# EAGLE design AC-DC-Supply-M1 (EAGLE 9.6.2)
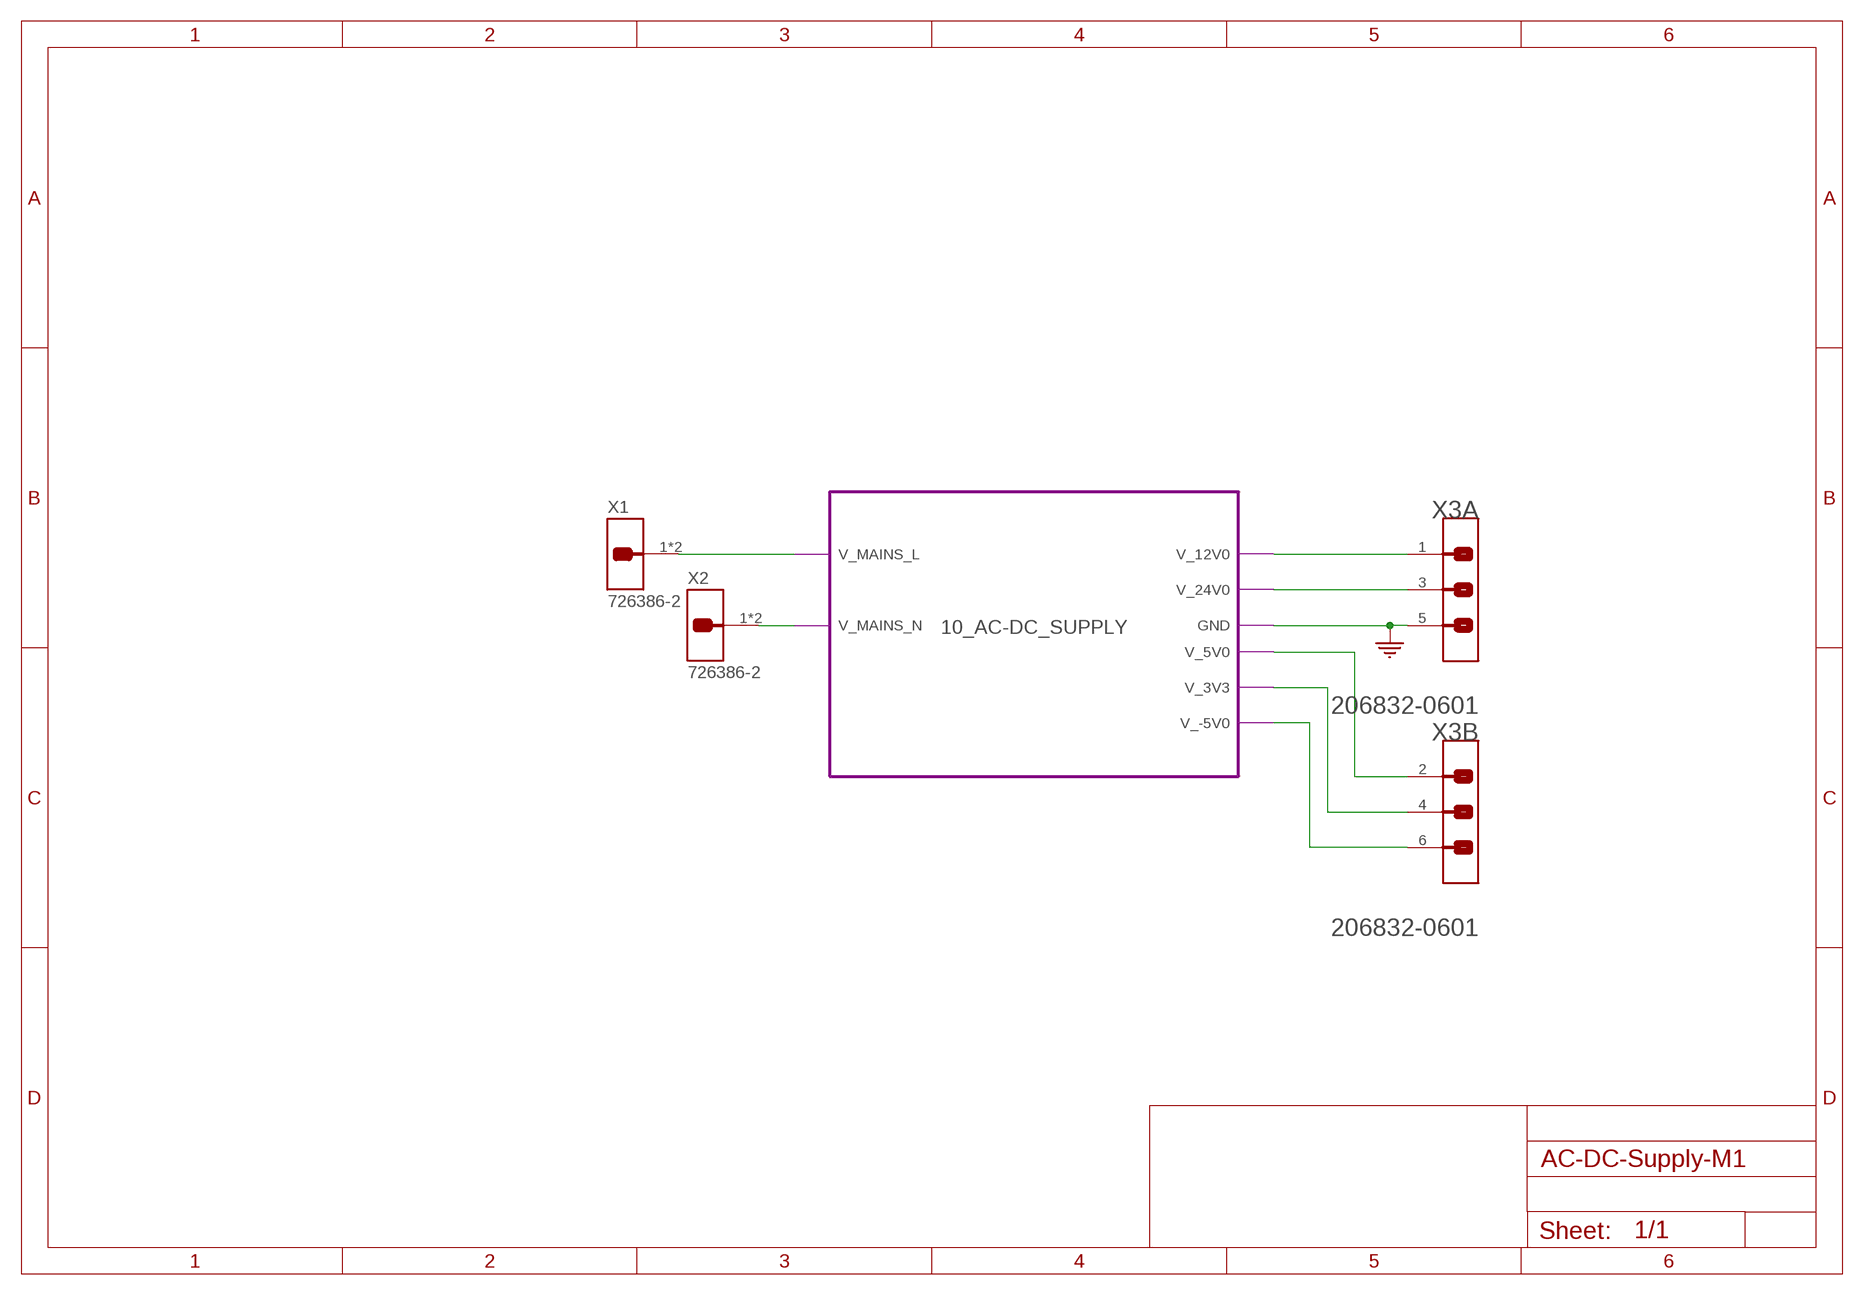
[diagram p0: schematic, sheet 1]

## Parts
X1  726386-2  [TE_726386-2_MODIFIED]
X2  726386-2  [TE_726386-2_MODIFIED]
X3  MOLEX_206832-0601MOLEX_206832-0601  [MOLEX_206832-0601]

## Module instances
10_AC-DC_SUPPLY = AC-DC_SUPPLY (part numbers offset by 100)

## Nets
GND: X3.5 ; port 10_AC-DC_SUPPLY.GND
N$1: X1.1 X1.1-2 ; port 10_AC-DC_SUPPLY.V_MAINS_L
N$2: X2.1 X2.1-2 ; port 10_AC-DC_SUPPLY.V_MAINS_N
V_3V3: X3.4 ; port 10_AC-DC_SUPPLY.V_3V3
V_5V0: X3.2 ; port 10_AC-DC_SUPPLY.V_5V0
V_12V0: X3.1 ; port 10_AC-DC_SUPPLY.V_12V0
V_24V0: X3.3 ; port 10_AC-DC_SUPPLY.V_24V0
V_-5V0: X3.6 ; port 10_AC-DC_SUPPLY.V_-5V0

## Library data of the parts
X1 X2 = Labops_Lib_AH:726386-2: Terminals, Faston, GDS-Flachstecker 6.3x0.8mm, TE; DESCRIPTION: 0.250" (6.35mm) Quick Connect Male - Solder Connector Non-Insulated; MFN: 726386-2; MFR: TE Connectivity; PART_VALUE: 6.35mmx8mm; PRICE-1: 0.24; SUPPLIER-1: Digikey
X3 = Labops_Lib_AH:MOLEX_206832-0601: Connector Header Through Hole 6 position 0.118" (3.00mm); DESCRIPTION: Connector Header Through Hole 6 position 3mm Microfit; LIB_STATUS: Prototype; MFN: 206832-0601; MFR: Molex; OUR_STOCK: 20; PART_VALUE: 6CCT x 2Row; PRICE-1: 1.32; SUPPLIER-1: Digikey

## Module AC-DC_SUPPLY
Ports: V_MAINS_L(io) V_MAINS_N(io) V_24V0(io) V_12V0(io) V_5V0(io) V_3V3(io) GND(io) V_-5V0(io)
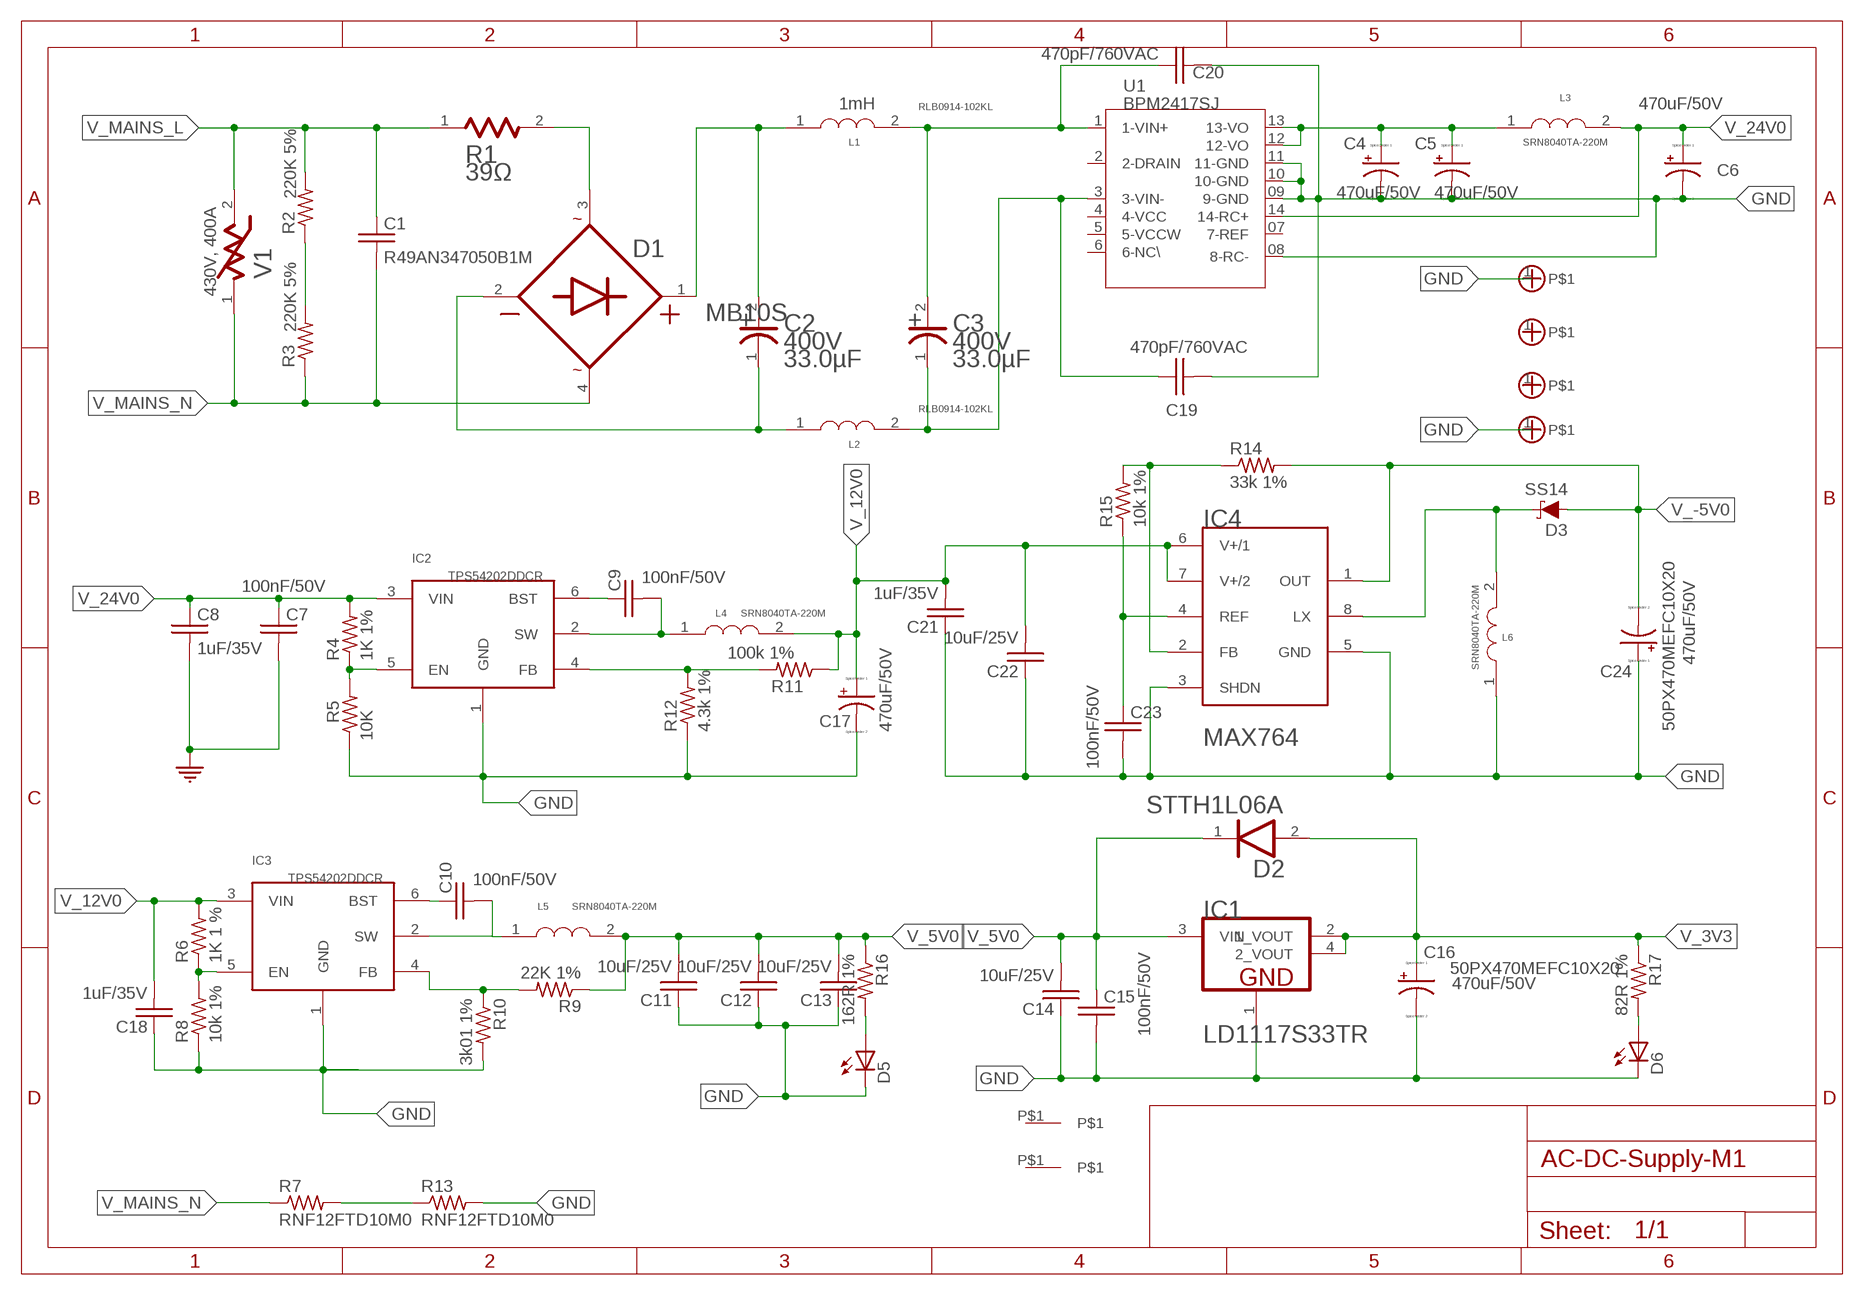
[diagram p1: schematic, module AC-DC_SUPPLY, sheet 1]

### Parts
C1  R49AN347050B1M  [R49AN347050B1M]
C2  860011378008  [RADIAL_D13.0P5.0H25.0]
C3  860011378008  [RADIAL_D13.0P5.0H25.0]
C4  50PX470MEFC10X20  [CAPACITOR-ELKO-RM5-10X16]
C5  50PX470MEFC10X20  [CAPACITOR-ELKO-RM5-10X16]
C6  50PX470MEFC10X20  [CAPACITOR-ELKO-RM5-10X16]
C7  100nF/50V  C_0603  [0603]
C8  1uF/35V  C_0603  [0603]
C9  100nF/50V  C_0603  [0603]
C10  100nF/50V  C_0603  [0603]
C11  10uF/25V  C_0603  [0603]
C12  10uF/25V  C_0603  [0603]
C13  10uF/25V  C_0603  [0603]
C14  10uF/25V  C_0603  [0603]
C15  100nF/50V  C_0603  [0603]
C16  50PX470MEFC10X20  [CAPACITOR-ELKO-RM5-10X16]
C17  50PX470MEFC10X20  [CAPACITOR-ELKO-RM5-10X16]
C18  1uF/35V  C_0603  [0603]
C19  ERP610W471MEF0  [CAP-P12.5-H15-W4-D1]
C20  ERP610W471MEF0  [CAP-P12.5-H15-W4-D1]
C21  1uF/35V  C_0603  [0603]
C22  10uF/25V  C_0603  [0603]
C23  100nF/50V  C_0603  [0603]
C24  50PX470MEFC10X20  [CAPACITOR-ELKO-RM5-10X16]
D1  MB10S  [SOIC4W]
D2  STTH1L06ASTMICROELECTRONICS_STTH1L06A_0_0  [SMA_STTH1L06A]
D3  SS14  [SMA]
D5  26-21/GPC-F3138B/CA  [SMD1206-LED]
D6  26-21/GPC-F3138B/CA  [SMD1206-LED]
FID1  FIDUCIAL  [FIDUCIAL]
FID2  FIDUCIAL  [FIDUCIAL]
IC1  LD1117S33TR  [SOT223_LD1117S33TR]
IC2  TPS54202DDCR  [SOT23-6]
IC3  TPS54202DDCR  [SOT23-6]
IC4  MAX764CSA+  [SOIC8]
L1  RLB0914-102KL  [THTINDUCTOR8MM7]
L2  RLB0914-102KL  [THTINDUCTOR8MM7]
L3  SRN8040TA-220M  [SRN8040TA-220M]
L4  SRN8040TA-220M  [SRN8040TA-220M]
L5  SRN8040TA-220M  [SRN8040TA-220M]
L6  SRN8040TA-220M  [SRN8040TA-220M]
M1  M_HOLE_3M  [PCB_SCREW_M3_POWER]
M2  M_HOLE_3M  [PCB_SCREW_M3_POWER]
M3  M_HOLE_3M  [PCB_SCREW_M3_POWER]
M4  M_HOLE_3M  [PCB_SCREW_M3_POWER]
R1  ERG-2SJ390V  [ERG-2SJ390V_0]
R2  R_1206  [R1206]
R3  R_1206  [R1206]
R4  1K 1%  R_0603  [R0603]
R5  10K  R_0603  [R0603]
R6  1K 1 %  R_0603  [R0603]
R7  RNF12FTD10M0  [RES-RM12.5-VR37]
R8  10k 1%  R_0603  [R0603]
R9  22K 1%  R_0603  [R0603]
R10  3k01 1%  R_0603  [R0603]
R11  100k 1%  R_0603  [R0603]
R12  4.3k 1%  R_0603  [R0603]
R13  RNF12FTD10M0  [RES-RM12.5-VR37]
R14  33k 1%  R_0603  [R0603]
R15  10k 1%  R_0603  [R0603]
R16  162R 1%  R_0603  [R0603]
R17  82R 1%  R_0603  [R0603]
U1  BPM2417SJ  [BPM2417SJ]
V1  B72205S0271K101B72205S2131K101  [EPCOS_B72205S0271K101_0]

### Nets
GND: C4.2(-) C5.2(-) C6.2(-) C7.2 C8.2 C11.1 C12.1 C13.1 C14.1 C15.2 C16.2(-) C17.2(-) C18.1 C19.P$2 C20.P$2 C21.1 C22.1 C23.2 C24.1(+) D5.2(C) D6.2(C) IC1.1(GND) IC2.1(GND) IC3.1(GND) IC4.3(SHDN) IC4.5(GND) L6.1 M1.1 M4.1 R5.1 R8.1 R10.2 R12.1 R13.2 U1.08(8-RC-) U1.09(9-GND) U1.10(10-GND) U1.11(11-GND)
N$1: IC2.4(FB) R11.2 R12.2
N$2: R2.1 R3.2
N$3: R7.2 R13.1
N$4: D1.3(1_~) R1.2
N$5: C2.2(ANODE) D1.1(+) L1.1
N$6: C2.1(CATHODE) D1.2(-) L2.1
N$7: C3.2(ANODE) C20.P$1 L1.2 U1.1(1-VIN+)
N$8: C3.1(CATHODE) C19.P$1 L2.2 U1.3(3-VIN-)
N$9: C9.2 IC2.2(SW) L4.1
N$10: IC2.5(EN) R4.1 R5.2
N$11: C4.1(+) C5.1(+) L3.1 U1.12(12-VO) U1.13(13-VO)
N$12: C9.1 IC2.6(BST)
N$13: C10.2 IC3.2(SW) L5.1
N$14: IC4.2(FB) R14.1 R15.2
N$15: IC3.4(FB) R9.2 R10.1
N$16: IC3.5(EN) R6.1 R8.2
N$17: D5.1(A) R16.2
N$18: D3.1(C) IC4.8(LX) L6.2
N$19: D6.1(A) R17.2
N$20: C23.1 IC4.4(REF) R15.1
N$21: C10.1 IC3.6(BST)
V_3V3: C16.1(+) D2.2(ANODE) IC1.2(1_VOUT) IC1.4(2_VOUT) R17.1
V_5V0: C11.2 C12.2 C13.2 C14.2 C15.1 D2.1(CATHODE) IC1.3(VIN) L5.2 R9.1 R16.1
V_12V0: C17.1(+) C18.2 C21.2 C22.2 IC3.3(VIN) IC4.6(V+/1) IC4.7(V+/2) L4.2 R6.2 R11.1
V_24V0: C6.1(+) C7.1 C8.1 IC2.3(VIN) L3.2 R4.2 U1.14(14-RC+)
V_-5V0: C24.2(-) D3.2(A) IC4.1(OUT) R14.2
V_MAINS_L: C1.1 R1.1 R2.2 V1.2
V_MAINS_N: C1.2 D1.4(2_~) R3.1 R7.1 V1.1
Unconnected: FID1.P$1 FID2.P$1 M2.1 M3.1 U1.2(2-DRAIN) U1.4(4-VCC) U1.5(5-VCCW) U1.6(6-NC\) U1.07(7-REF)

### Library data of the parts
C1 = Labops_Lib_AH:R49AN347050B1M: 0.47µF X Cap 330V 800V Polypropylene (PP), Metallized Radial; DESCRIPTION: Film,X1,470nF/330Vac,THT; LIB_STATUS: Verified; MFN: R49AN347050B1M; MFR: Kemet; OUR_STOCK: 8; PART_VALUE: 470nF/330VAC; PRICE-1: 1.51; SUPPLIER-1: Digikey
C2 C3 = Labops_Lib_AH:860011378008: Aluminium Electrolytic Capacitor, WCAP-ATG8 Series, 33 F, 20%, 400 V, 13 mm, Radial Leaded; DESCRIPTION: Electrolytic Cap 33µF 400V 13mm Radial WCAP-ATG8; Lifetime 2000h +85°C; LIB_STATUS: Verified; MFN: 860011378008; MFR: Wurth Elektronik; OUR_STOCK: 4; PART_VALUE: 33uF/400V; SUPPLIER-1: Digikey
C4-C6 C16 C17 C24 = Labops_Lib_AH:50PX470MEFC10X20: Electrolytic Cap, 470µF, 25V, Low ESR, Kemet, Pitch=5mm, Dia=10mm, L=12,5mm; DESCRIPTION: 470uF ±20% 50V 10mm 20mm 5mm 2000Hrs @ 105℃ -55℃ ~ +105℃; LIB_STATUS: Prototype; MFN: 50PX470MEFC10X20; MFR: Rubicon; OUR_STOCK: 20; PART_VALUE: 470uF/50V; PRICE-1: 0.14; SUPPLIER-1: LCSC; TECHNOLOGY: THT
C7-C15 C18 C21-C23 = Labops_Lib_AH:C_0603; MFN: Open Source
C19 C20 = Labops_Lib_AH:ERP610W471MEF0; DESCRIPTION: 470 pF ±20% 760VAC Ceramic Capacitor Y5U (E) Radial X1,Y1; LIB_STATUS: Prototype; MFN: ERP610W471MEF0; MFR: Kemet; OUR_STOCK: 150; PART_VALUE: 470pF/760VAC; PRICE-1: 0.42; SUPPLIER-1: Digikey
D1 = Labops_Lib_AH:MB10S; DESCRIPTION: 0.5 A 1000 V Low Leakage SMT Bridge Rectifier - SOIC-4; LIB_STATUS: Prototype; MFN: MB10S; MFR: On Semi, Diodes,MDD; PART_VALUE: Bridge Rectifier; PRICE-1: 0.02; STOCK: 10; SUPPLIER-1: Digikey
D2 = Labops_Lib_AH:STTH1L06A: Diode Standard 600V 1A Surface Mount SMA; AUTOMOTIVE: No; CENTROID_NOT_SPECIFIED: No; DATASHEET: https://www.st.com/content/ccc/resource/technical/document/datasheet/e9/c2/09/e3/32/47/44/bd/CD00002694.pdf/files/CD00002694.pdf/jcr:content/translations/en.CD00002694.pdf; DEVICE_CLASS_L1: Discrete Semiconductors; DEVICE_CLASS_L2: Diodes; DEVICE_CLASS_L3: Rectifier Diodes; DIGIKEY_DESCRIPTION: DIODE GEN PURP 600V 1A SMA; DIGIKEY_PART_NUMBER: 497-3241-2-ND; FOOTPRINT_VARIANT_NAME_0: Recommended_Land_Pattern; FORWARD_CURRENT: 1A; HEIGHT: 2.65mm; LEAD_FREE: Yes; MAX_JUNCTION_TEMP: +175°C; MAX_REPETITIVE_REVERSE_VOLTAGE: 600V; MAX_SURGE_FORWARD_CURRENT: 20A; MF: STMicroelectronics; MFG_PACKAGE_IDENT: SMA; MFG_PACKAGE_IDENT_COMPONENT_ID: 68520089bca91e26; MFG_PACKAGE_IDENT_DATE: 0; MFG_PACKAGE_IDENT_REV: 0; MOUSER_DESCRIPTION: DIODE GEN PURP 600V 1A SMA; MOUSER_PART_NUMBER: 511-STTH1L06A; MPN: STTH1L06A; PACKAGE: SMA; PEAK_REVERSE_CURRENT: 1uA; PREFIX: D; ROHS: Yes; STANDOFF_HEIGHT: 0.05mm; TEMPERATURE_RANGE_HIGH: +175°C; VERIFICATION_VERSION: 0.0.0.3
D3 = Labops_Lib_AH:SS14; DESCRIPTION: Diode Schottky 1A/40V (SMA); LIB_STATUS: Prototype; MFN: SS14-LTP; MFR: MCC; OUR_STOCK: 10; PART_VALUE: Schottky 1A/40V; PRICE-1: 0.05; SUPPLIER-1: LCSC
D5 D6 = Labops_Lib_AH:26-21/GPC-F3138B/CA; DESCRIPTION: Green SMD LED 1206, 160mcd; LIB_STATUS: Prototype; MFN: 26-21/GPC-F3138B/CA; MFR: Everlight; OUR_STOCK: 50; PART_VALUE: Green LED; PRICE-1: 0.06; SUPPLIER-1: LCSC
FID1 FID2 = Labops_Lib_AH:FIDUCIAL
IC1 = Labops_Lib_AH:LD1117S33TR: IC REG LINEAR 3.3V 800mA SOT223; DESCRIPTION: LDO,Fixed 15V 3.3V 1.3V @ 800mA SOT-223; LIB_STATUS: Verified; MFN: LD1117S33TR; MFR: STmicro, Diodes, TI,; OUR_STOCK: 10; PART_VALUE: xx1117x33xx; PRICE_1: 0.07; SUPPLIER-1: LCSC
IC2 IC3 = Labops_Lib_AH:TPS54202DDCR; DESCRIPTION: 2A 28V SOT-23-6 Sync Buck; LIB_STATUS: Prototype; MFN: TPS54202DDCR; MFR: Texas Instruments; OUR_STOCK: 40; PART_VALUE: TPS54202; PRICE-1: 1.8; SUPPLIER-1: LCSC
IC4 = Labops_Lib_AH:MAX764CSA+; MFN: MAX764CSA+; MFR: Max IC; OUR_STOCK: 30; PART_VALUE: Buck/Boost IC; PRICE-1: 4.0; SUPPLIER-1: Mouser
L1 L2 = Labops_Lib_AH:RLB0914-102KL; DESCRIPTION: Inductor Power Wirewound 1mH 10% 252KHz 40Q-Factor Ferrite 300mA 2.1Ohm; LIB_STATUS: Prototype; MFN: RLB0914-102KL; MFR: Bourns; OUR_STOCK: 0; PART_VALUE: 1mH; PRICE-1: 0.42; SUPPLIER-1: Digikey
L3-L6 = Labops_Lib_AH:SRN8040TA-220M: FIXED IND 22UH 2.9A SMD, 73m-Ohm, Bourns; DESCRIPTION: FIXED IND 22UH 2.9A SMD, 73m-Ohm, Bourns; LIB_STATUS: Verified; MFN: SRN8040TA-220M; MFR: Bourns; OUR_STOCK: 10; PART_VALUE: 22uH/2.9A; SUPPLIER-1: Digikey; TECHNOLOGY: SMD
M1-M4 = Labops_Lib_AH:M_HOLE_3M
R1 = Labops_Lib_AH:ERG-2SJ390V: RES 39 OHM 2W 5% AXIAL, Metal Oxide, Panasonic
R2 R3 = Labops_Lib_AH:R_1206; LIB_STATUS: Verified; MFN: CRCW1206220KJNEAHP; MFR: Vishay; PART_VALUE: 220K 5%
R4-R6 R8-R12 R14-R17 = Labops_Lib_AH:R_0603; MFN: Open Source
R7 R13 = Labops_Lib_AH:RNF12FTD10M0; DESCRIPTION: 10 MOhms ±1% 0.5W, 1/2W Through Hole Resistor Axial Flame Retardant Coating, Safety Metal Film; LIB_STATUS: Prototype; MFN: RNF12FTD10M0; MFR: Stackpole Electronics Inc; OUR-STOCK: 20; PART_VALUE: 10Meg 5%; PRICE-1: 0.29; SUPPLIER-1: Digikey
U1 = Labops_Lib_AH:BPM2417SJ; DESCRIPTION: Ac/Dc Power Supply Module; LIB_STATUS: Prototype; MFN: BPM2417SJ; MFR: Tamura; OUR_STOCK: 5; PART_VALUE: Power Sources; PRICE-1: 7.00; SUPPLIER-1: Digikey
V1 = Labops_Lib_AH:B72205S0271K101: VARISTOR 205V 800A DISC 5MM; LIB_STATUS: Verified; MFN: B72205S0271K1011; MFR: EPCOS; OUR_STOCK: 10; PART_VALUE: 430V, 400A; PRICE-1: 0.31; SUPPLIER-1: Digikey

## Board
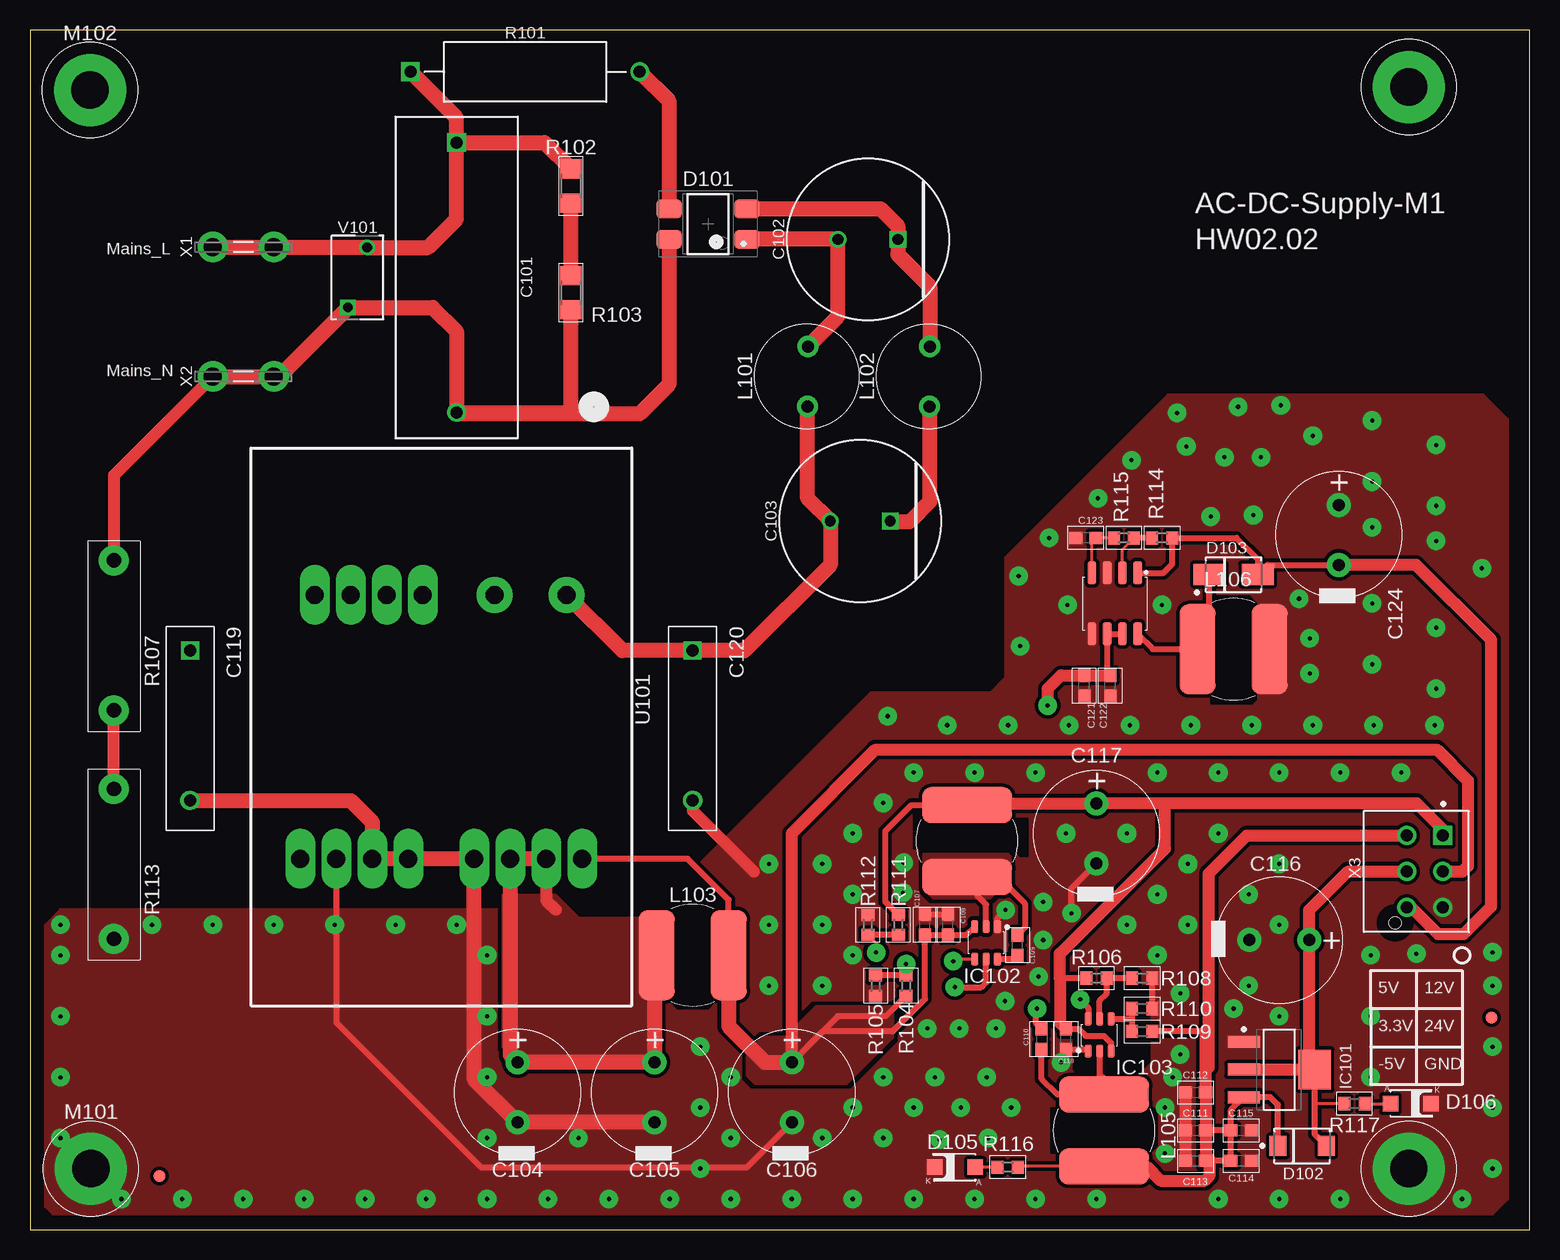
[diagram p2: board, top side]
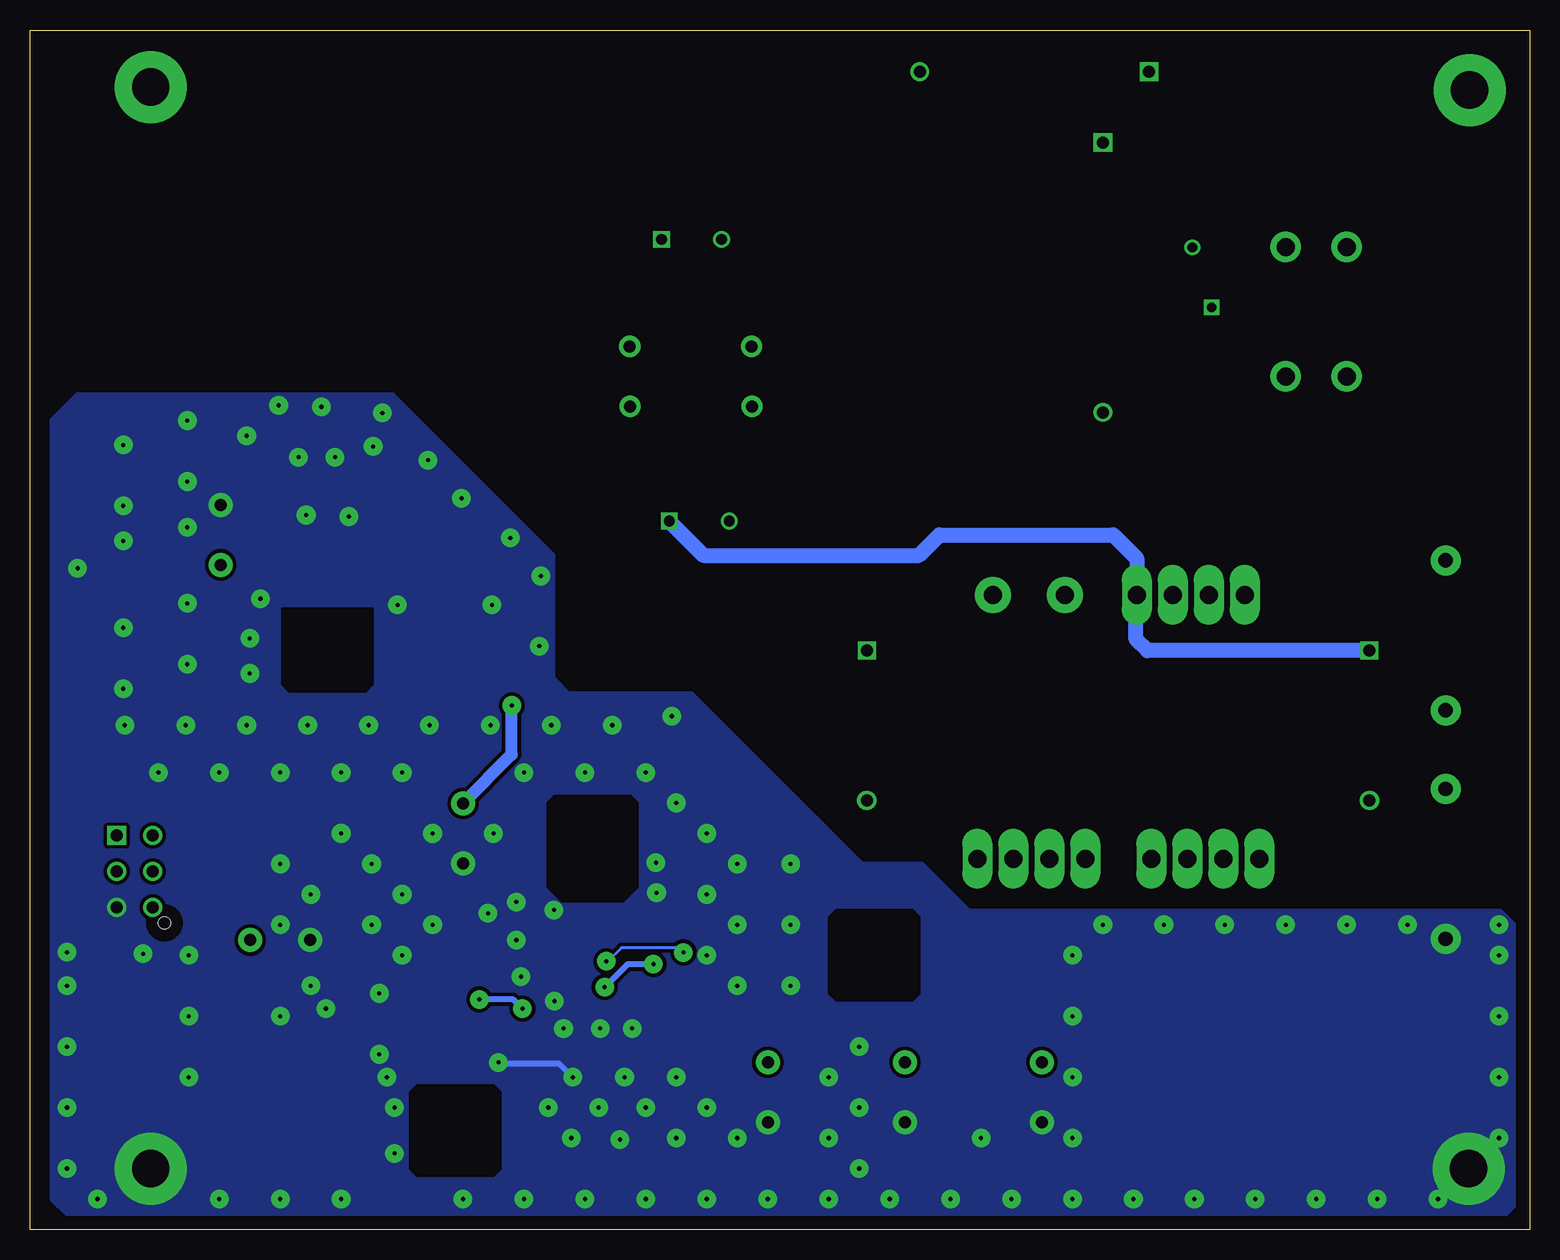
[diagram p3: board, bottom side, seen from below]

Size 125 x 100 mm. Coordinates in mm from the lower left corner, seen from the top.
Outline: 0,0 125,0 125,100 0,100 0,0
Copper layers (1*16): Top 0.07mm / dielectric 1.5mm / Bottom 0.07mm
Design rules "AH_V01 *": minimum track width 0.2mm, minimum drill 0.3mm, track to track 0.3mm, track to pad 0.3mm, pad to pad 0.3mm, via to via 0.4mm, smd to smd 0mil, copper to edge 40mil, drill to drill 6mil, minimum pad ring 0.2mm, minimum via ring 0.6mm, stop-mask expansion 4mil, vias tented up to drill 0.5mm, thermal gap 10mil

### Footprints (pad centres in the part's own frame; a part is rotated, then mirrored left to right if it is on the bottom)
R49AN347050B1M = drill 1 pad 1.55 square: 1 -11.25,0 | drill 1 pad 1.55: 2 11.25,0
RADIAL_D13.0P5.0H25.0 = drill 0.9 pad 1.4 square: 1 -2.5,0 | drill 0.9 pad 1.4: 2 2.5,0
CAPACITOR-ELKO-RM5-10X16 = drill 1 pad 2: 1 -2.5,0; 2 2.5,0
0603 = smd 1.1 x 1: 1 -0.85,0; 2 0.85,0
CAP-P12.5-H15-W4-D1 = drill 1 square: P$1 0,0 | drill 1 pad 1.6: P$2 12.5,0
SOIC4W = smd 2.1 x 1.55: 1 -3.25,1.27; 2 -3.25,-1.27; 3 3.25,-1.27; 4 3.25,1.27
SMA_STTH1L06A = smd 1.4 x 1.64: 1 -2.015,0; 2 2.015,0
SMA = smd 2.65 x 1.75: 1 -2.015,0; 2 2.015,0
SMD1206-LED = smd 1.3 x 1.3: 1 -1.7,0; 2 1.7,0
FIDUCIAL = smd 1 x 1: P$1 0,0
SOT223_LD1117S33TR = smd 2.7 x 1: 1 -2.95,2.3; 2 -2.95,0; 3 -2.95,-2.3 | smd 2.7 x 3.3: 4 2.95,0
SOT23-6 = smd 0.6 x 1.1: 1 -0.95,-1.35; 2 0,-1.35; 3 0.95,-1.35; 4 0.95,1.35; 5 0,1.35; 6 -0.95,1.35
SOIC8 = smd 1.9 x 0.72: 1 -2.54,1.905; 2 -2.54,0.635; 3 -2.54,-0.635; 4 -2.54,-1.905; 5 2.54,-1.905; 6 2.54,-0.635; 7 2.54,0.635; 8 2.54,1.905
THTINDUCTOR8MM7 = drill 1 pad 1.762: 1 -2.5,0.075; 2 2.5,0.05
SRN8040TA-220M = smd 3 x 7.5: 1 -3,0; 2 3,0
PCB_SCREW_M3_POWER = drill 3.1 pad 6: 1 0,0
ERG-2SJ390V_0 = drill 1 pad 1.55 square: 1 -9.555,0 | drill 1 pad 1.55: 2 9.555,0
R1206 = smd 1.6 x 1.803: 1 -1.422,0; 2 1.422,0
R0603 = smd 1 x 1.1: 1 -0.85,0; 2 0.85,0
RES-RM12.5-VR37 = drill 1.2 pad 2.5: 1 -6.25,0; 2 6.25,0
BPM2417SJ = drill 1.5 pad 3: 1 -11,10.45; 2 -11,4.45 | drill 1.5 pad 2.5 long: 3 -11,-1.55; 4 -11,-4.55; 5 -11,-7.55; 6 -11,-10.55; 07 11,-11.75; 08 11,-8.75; 09 11,-5.75; 10 11,-2.75; 11 11,2.75; 12 11,5.75; 13 11,8.75; 14 11,11.75
EPCOS_B72205S0271K101_0 = drill 0.8 pad 1.3 square: 1 -2.5,0.8 | drill 0.8 pad 1.3: 2 2.5,-0.8
TE_726386-2_MODIFIED = drill 1.5 pad 2.54: 1 -2.54,0; 1-2 2.54,0
MOLEX_206832-0601 = drill 1.02 pad 1.57 square: 1 3,-2.2 | drill 1.02 pad 1.57: 2 3,0.8; 3 0,-2.2; 4 0,0.8; 5 -3,-2.2; 6 -3,0.8 | hole 1.02: -4.28,1.78

### Placement (x,y rotation side)
C101  R49AN347050B1M  [R49AN347050B1M]  35.56,79.38 270 top
C102  860011378008  [RADIAL_D13.0P5.0H25.0]  69.85,82.55 180 top
C103  860011378008  [RADIAL_D13.0P5.0H25.0]  69.22,59.05 180 top
C104  50PX470MEFC10X20  [CAPACITOR-ELKO-RM5-10X16]  40.64,11.43 270 top
C105  50PX470MEFC10X20  [CAPACITOR-ELKO-RM5-10X16]  52.07,11.43 270 top
C106  50PX470MEFC10X20  [CAPACITOR-ELKO-RM5-10X16]  63.5,11.43 270 top
C107  100nF/50V  [0603]  74.61,25.41 90 top
C108  1uF/35V  [0603]  76.52,25.41 90 top
C109  100nF/50V  [0603]  82.33,23.7 90 top
C110  100nF/50V  [0603]  84.33,15.88 270 top
C111  10uF/25V  [0603]  97.16,8.26 0 top
C112  10uF/25V  [0603]  97.16,11.43 0 top
C113  10uF/25V  [0603]  97.16,5.71 0 top
C114  10uF/25V  [0603]  100.97,5.71 180 top
C115  100nF/50V  [0603]  100.97,8.26 0 top
C116  50PX470MEFC10X20  [CAPACITOR-ELKO-RM5-10X16]  104.14,24.13 180 top
C117  50PX470MEFC10X20  [CAPACITOR-ELKO-RM5-10X16]  88.9,33.02 270 top
C118  1uF/35V  [0603]  86.36,15.88 90 top
C119  ERP610W471MEF0  [CAP-P12.5-H15-W4-D1]  13.34,48.26 270 top
C120  ERP610W471MEF0  [CAP-P12.5-H15-W4-D1]  55.24,48.26 270 top
C121  1uF/35V  [0603]  87.88,45.34 90 top
C122  10uF/25V  [0603]  90.04,45.34 90 top
C123  100nF/50V  [0603]  88.01,57.66 180 top
C124  50PX470MEFC10X20  [CAPACITOR-ELKO-RM5-10X16]  109.09,57.91 270 top
D101  MB10S  [SOIC4W]  56.52,83.82 180 top
D102  STTH1L06ASTMICROELECTRONICS_STTH1L06A_0_0  [SMA_STTH1L06A]  106.05,6.99 0 top
D103  SS14  [SMA]  100.33,54.61 0 top
D105  26-21/GPC-F3138B/CA  [SMD1206-LED]  77.1,5.2 180 top
D106  26-21/GPC-F3138B/CA  [SMD1206-LED]  115.1,10.5 0 top
FID101  FIDUCIAL  [FIDUCIAL]  121.85,17.65 0 top
FID102  FIDUCIAL  [FIDUCIAL]  10.79,4.45 0 top
IC101  LD1117S33TR  [SOT223_LD1117S33TR]  104.14,13.34 0 top
IC102  TPS54202DDCR  [SOT23-6]  79.7,23.9 180 top
IC103  TPS54202DDCR  [SOT23-6]  89.17,16.21 0 top
IC104  MAX764CSA+  [SOIC8]  90.42,52.2 270 top
L101  RLB0914-102KL  [THTINDUCTOR8MM7]  64.77,71.12 270 top
L102  RLB0914-102KL  [THTINDUCTOR8MM7]  74.93,71.12 270 top
L103  SRN8040TA-220M  [SRN8040TA-220M]  55.24,22.86 0 top
L104  SRN8040TA-220M  [SRN8040TA-220M]  78.11,32.38 90 top
L105  SRN8040TA-220M  [SRN8040TA-220M]  89.53,8.26 270 top
L106  SRN8040TA-220M  [SRN8040TA-220M]  100.33,48.39 180 top
M101  M_HOLE_3M  [PCB_SCREW_M3_POWER]  5.08,5.08 0 top
M102  M_HOLE_3M  [PCB_SCREW_M3_POWER]  5,95 0 top
M103  M_HOLE_3M  [PCB_SCREW_M3_POWER]  114.94,95.25 0 top
M104  M_HOLE_3M  [PCB_SCREW_M3_POWER]  114.94,5.08 0 top
R101  ERG-2SJ390V  [ERG-2SJ390V_0]  41.27,96.52 0 top
R102  R_1206  [R1206]  45.09,87 90 top
R103  R_1206  [R1206]  45.09,78.11 90 top
R104  1K 1%  [R0603]  73.03,20.32 270 top
R105  10K  [R0603]  70.48,20.32 90 top
R106  1K 1 %  [R0603]  88.9,20.95 180 top
R107  RNF12FTD10M0  [RES-RM12.5-VR37]  6.99,49.53 270 top
R108  10k 1%  [R0603]  92.71,20.95 180 top
R109  22K 1%  [R0603]  92.71,16.51 180 top
R110  3k01 1%  [R0603]  92.71,18.41 0 top
R111  100k 1%  [R0603]  72.39,25.4 270 top
R112  4.3k 1%  [R0603]  69.85,25.4 270 top
R113  RNF12FTD10M0  [RES-RM12.5-VR37]  6.99,30.48 270 top
R114  33k 1%  [R0603]  94.36,57.66 0 top
R115  10k 1%  [R0603]  91.19,57.66 0 top
R116  162R 1%  [R0603]  81.5,5.2 180 top
R117  82R 1%  [R0603]  110.4,10.5 0 top
U101  BPM2417SJ  [BPM2417SJ]  34.29,41.91 270 top
V101  B72205S0271K101B72205S2131K101  [EPCOS_B72205S0271K101_0]  27.3,79.38 90 top
X1  17.78,81.92 180 top
X2  17.78,71.12 180 top
X3  115.57,29.84 90 top

### Tracks (layer width: path | path; a pad name or v marks a point on that pad's centre or on a via)
10_AC-DC_SUPPLY:N$1  (via drill 0.35)
  Top 0.254: R112.2 70.5,23.9 70.5,23.13 v70.53,23.1 | v76.96,22.36 77.15,22.55 IC102.4
  Top 0.508: R111.2 R112.2
  Bottom 0.254: v70.53,23.1 70.93,23.5 75.7,23.5 76.9,22.3 v76.96,22.36
10_AC-DC_SUPPLY:N$2
  Top 1.27: R103.2 R102.1
10_AC-DC_SUPPLY:N$3
  Top 1.016: R113.1 R107.2
10_AC-DC_SUPPLY:N$4
  Top 1.27: R101.2 53.27,94.08 D101.3
10_AC-DC_SUPPLY:N$5
  Top 1.27: D101.1 C102.2 67.35,76.12 L101.1
10_AC-DC_SUPPLY:N$6
  Top 1.27: D101.2 70.91,85.09 72.35,83.65 C102.1 72.35,81.28 75,78.62 L102.1
10_AC-DC_SUPPLY:N$7
  Top 1.27: L101.2 64.82,60.95 C103.2 66.72,55.41 59.56,48.26 C120.P$1 49.39,48.26 U101.1
10_AC-DC_SUPPLY:N$8
  Top 1.27: L102.2 74.98,60.68 73.3,59 71.77,59 C103.1
  Bottom 1.27: C103.1 68.86,56.2 50.9,56.2 49.2,57.9 34.7,57.9 32.74,55.94 U101.3 32.8,52.85 32.8,49.2 31.86,48.26 C119.P$1
10_AC-DC_SUPPLY:N$9
  Top 0.508: C109.2 82.93,25.15 82.93,27.17 80.72,29.39 L104.1 78.99,28.5 78.99,27.8 79.7,27.09 IC102.2
  pour Top (no thermals): 80.01,27.56 75.31,27.56 74.42,28.45 74.42,31.37 81.53,31.37 81.79,31.11 81.79,29.34
10_AC-DC_SUPPLY:N$10  (via drill 0.35)
  Top 0.508: R105.2 R104.1 v73.03,22.12 | v77.1,20.2 79.3,20.2 79.7,20.6 IC102.5
  Bottom 0.508: v73.03,22.12 75.17,22.12 v77.1,20.2
10_AC-DC_SUPPLY:N$11
  Top 1.016: U101.13 43.04,27.45 43.81,26.67
  Top 1.27: U101.13 U101.12 40.04,14.53 C104.1 C105.1 52.07,22.68 L103.1
  pour Top (no thermals): 39.37,27.94 43.81,27.94 45.72,26.04 50.8,26.04 52.07,24.77 52.07,17.78 52.07,15.24 50.8,13.97 40.64,13.97 39.37,15.24
10_AC-DC_SUPPLY:N$12
  Top 0.508: IC102.6 82.03,22.55 C109.1
10_AC-DC_SUPPLY:N$13
  Top 0.508: IC103.2 89.17,12.95 | 89.17,12.95 89.17,11.62 | C110.2 84.33,12.57 85.65,11.26 L105.1 89.53,12.58 89.17,12.95
10_AC-DC_SUPPLY:N$14
  Top 0.254: IC104.2 91.06,56.68 R115.2
  Top 0.508: R114.1 R115.2
10_AC-DC_SUPPLY:N$15
  Top 0.508: R110.1 91.86,17.53 | 91.86,17.53 R109.2 | IC103.4 91.83,17.56 91.86,17.53
10_AC-DC_SUPPLY:N$16
  Top 0.508: R108.2 R106.1 89.75,19.65 89.17,19.06 IC103.5
10_AC-DC_SUPPLY:N$17
  Top 0.254: R116.2 | R116.2 D105.1
10_AC-DC_SUPPLY:N$18
  Top 0.508: IC104.8 93.6,48.39 L106.2 98.31,49.37 D103.1
10_AC-DC_SUPPLY:N$19
  Top 0.254: R117.2 D106.1 | D106.1
10_AC-DC_SUPPLY:N$20
  Top 0.254: R115.1 C123.1 88.52,57.32 IC104.4
10_AC-DC_SUPPLY:N$21  (via drill 0.35)
  Top 0.508: C110.1 83.82,17.23 83.82,18.29 v83.95,18.41 | v87.53,19.18 88.22,18.5 IC103.6
  Bottom 0.508: v83.95,18.41 84.71,19.18 v87.53,19.18
COIL2-CUTOUT
  cutout Top (no thermals): 53.34,26.67 53.98,27.3 54.61,27.3 56.52,27.3 57.15,26.67 57.15,19.05 56.52,18.41 53.98,18.41 53.34,19.05
  cutout Top (no thermals): 98.42,52.2 99.06,52.84 101.6,52.84 102.23,52.2 102.23,44.2 101.85,43.81 98.42,43.81
COIL_CUTOUT
  cutout Top (no thermals): 73.66,34.92 73.66,31.75 81.92,31.75 82.55,31.11 83.19,31.11 83.19,34.29 81.92,34.29 81.28,33.66 74.93,33.66 74.3,34.29 74.3,34.92
COIL_CUTOUT_BOT
  cutout Bottom (no thermals): 53.34,26.67 51.44,26.67 50.8,26.04 50.8,19.68 51.44,19.05 57.78,19.05 58.42,19.68 58.42,26.04 57.78,26.67
  cutout Bottom (no thermals): 74.3,31.11 74.3,28.57 75.56,27.3 80.64,27.3 81.92,28.57 81.92,35.56 81.28,36.2 74.93,36.2 74.3,35.56
  cutout Bottom (no thermals): 88.27,12.06 86.36,12.06 85.72,11.43 85.72,5.08 86.36,4.45 92.71,4.45 93.34,5.08 93.34,11.43 92.71,12.06
  cutout Bottom (no thermals): 104.01,51.82 96.39,51.82 96.39,45.47 97.03,44.83 103.38,44.83 104.01,45.47
CUTOUT02
  cutout Top (no thermals): 92.71,20.32 87,20.32 87,13.34 87.63,12.7 92.08,12.7 92.71,13.34 93.34,13.97 93.34,20.32
CUTOUT_CLEAR_HV_LV
  cutout Top: 81.15,57.15 81.15,46.1 81.03,45.97 80.01,44.96 68.07,44.96 80.26,57.15
  cutout Bottom: 81.15,57.15 81.15,46.1 81.03,45.97 80.01,44.96 68.07,44.96 80.26,57.15
CUTOUT_COIL3
  cutout Top (no thermals): 85.09,10.16 85.09,6.35 93.34,6.35 93.98,6.99 93.98,10.16
GND  (via drill 0.35)
  Top 0.508: U101.08 25.54,17.26 37.59,5.21 59.78,5.21 C106.2 | R110.2 R108.1 | C107.2 C108.2 | IC102.1 80.65,25.97 v81.32,26.64 | v86.82,26.36 86.82,28.44 C117.2 | IC103.1 88.05,15.03 C118.1 86.36,14.86 85.94,14.44 v85.94,13.93 | 109.05,60.45 C124.1
  Top 1.016: C112.1 C113.1 | C120.P$2 55.24,34.92 60.33,29.84
  Top 1.27: C105.2 C104.2 37.04,12.53 U101.11 U101.10 U101.09 28.54,33.96 26.74,35.76 C119.P$2
  Bottom 0.508: v85.94,13.93 85.86,13.84 80.9,13.84 v79.76,12.7
  other vias: 2.54,22.86 2.54,17.78 2.54,12.7 2.54,7.62 7.62,2.54 12.7,2.54 17.78,2.54 22.86,2.54 27.94,2.54 33.02,2.54 38.1,2.54 43.18,2.54 48.26,2.54 53.34,2.54 58.42,2.54 63.5,2.54 68.58,2.54 73.66,2.54 78.74,2.54 83.82,2.54 88.9,2.54 99.06,2.54 104.14,2.54 109.22,2.54 119.38,2.54 121.92,5.08 121.92,10.16 121.92,15.24 121.92,20.32 121.92,23.11 115.57,22.99 114.3,38.1 109.22,38.1 104.14,38.1 99.06,38.1 93.98,38.1 83.82,38.1 78.74,38.1 73.66,38.1 71.12,35.56 68.58,33.02 66.04,30.48 68.58,27.94 66.04,25.4 68.58,22.86 66.04,20.32 91.44,33.02 86.36,33.02 99.06,33.02 96.52,30.48 93.98,27.94 96.52,25.4 93.98,22.86 91.44,25.4 104.14,30.48 101.6,27.94 104.14,25.4 101.6,20.32 104.14,17.78 111.76,17.78 111.76,22.86 111.76,12.7 79.88,7.62 72.82,30.58 81.28,19.05 80.52,16.76 77.6,10.16 71.12,12.7 73.66,10.16 68.58,10.16 66.04,7.62 71.12,7.62 81.79,10.16 55.88,15.24 55.88,10.16 55.88,5.08 58.42,7.62 58.42,12.7 45.72,7.62 38.1,7.62 38.1,12.7 38.1,17.78 38.1,22.86 35.56,25.4 30.48,25.4 25.4,25.4 20.32,25.4 15.24,25.4 10.16,25.4 2.54,25.4 95.89,14.61 95.25,12.7 94.61,10.16 94.61,6.35 95.89,19.68 100.33,18.41 61.59,30.48 61.59,25.4 61.59,20.32 72.77,28.07 84.45,27.3 84.45,24.13 84.07,21.08 75.44,12.7 75.82,7.49 77.47,16.76 74.8,16.76 111.89,67.44 111.89,62.36 111.89,58.55 111.89,52.2 111.89,47.12 91.82,64.14 95.63,68.07 96.39,65.28 98.42,59.44 89.03,60.96 101.98,59.56 121.03,55.12 71.5,42.8 84.96,57.66 100.71,68.58 117.09,42.04 112.01,42.04 106.93,42.04 101.85,42.04 96.77,42.04 91.69,42.04 86.61,42.04 81.53,42.04 76.45,42.04 99.57,64.39 102.62,64.39 117.22,65.41 117.22,60.33 117.22,57.4 117.22,50.16 117.22,45.09 104.27,68.71 106.93,66.17 106.68,46.35 86.49,52.07 82.42,54.48 82.55,48.64 106.68,49.28 105.79,52.58 94.36,52.07
  pour Top (rank 2, no thermals): 1.27,1.91 1.91,1.27 121.92,1.27 123.19,2.54 123.19,67.56 121.16,69.6 94.87,69.6 55.75,30.48 52.07,30.48 48.26,26.67 2.54,26.67 1.27,25.4
  pour Bottom (no thermals): 1.2,25.5 1.2,1.9 1.9,1.2 122,1.2 123.3,2.5 123.3,67.53 121.11,69.72 94.73,69.72 55.61,30.6 50.6,30.6 46.7,26.7 2.4,26.7
N$1
  Top 1.27: X1.1-2 X1.1 28.07,81.92 V101.2 33.19,81.88 35.56,84.25 C101.1 | C101.1 35.56,92.68 R101.1 | C101.1 42.88,90.62 R102.2
N$2
  Top 1.016: X2.1-2 6.99,62.87 R107.1
  Top 1.27: X2.1-2 X2.1 20.75,71.12 V101.1 33.57,76.88 35.56,74.89 C101.2 | C101.2 45.09,68.12 R103.1 | D101.4 53.27,70.45 50.81,68 35.69,68 C101.2
V_3V3
  Top 0.254: R117.1 107.19,10.5 107.09,10.4
  Top 0.508: D102.2 107.09,7.96 107.09,10.4 IC101.4
  Top 1.016: X3.4 109.86,29.84 106.64,26.63 C116.1 106.64,13.79 IC101.4 IC101.2
V_5V0
  Top 0.254: C113.2 98.22,5.93 98.3,5.93 | L105.2 82.41,5.25 R116.1
  Top 0.508: 98,16.51 R109.1 | C113.2 C114.2 C115.1 | C115.1 C111.2 | C115.1 100.11,9.96 IC101.3 103.39,11.04 104.03,10.4 D102.1
  Top 1.016: C113.2 C111.2 C112.2 98,13.76 | 98,13.76 98,16.51 | 98,13.76 98.26,13.5 98.26,29.68 101.42,32.84 X3.2 | L105.2 93.04,5.25 94.23,4.06 97.92,4.06 98.3,4.45 98.3,5.93
V_12V0  (via drill 0.35)
  Top 0.508: R111.1 71.29,27.35 71.29,33.19 73.48,35.38 L104.2 | C118.2 87.42,16.73 88.01,16.13 89.53,16.13 90.11,15.55 IC103.3 | R106.2 85.85,20.95 | C122.2 89.79,46.44 IC104.6 IC104.7
  Top 1.016: L104.2 78.24,35.52 C117.1 88.94,35.56 94.61,35.56 | 94.61,35.56 115.57,35.56 117.77,33.36 X3.1 | C118.2 85.85,17.23 85.85,20.95 85.85,22.99 94.61,31.75 94.61,35.56 | v84.84,43.69 84.84,45.09 85.94,46.19 C121.2 C122.2
  Bottom 1.016: C117.1 84.84,39.58 v84.84,43.69
V_24V0
  Top 0.508: L103.2 58.24,27.48 54.81,30.91 U101.14 | R104.2 71.33,17.78 67.35,17.78 C106.1 66.08,16.51 71.9,16.51 74.61,19.23 C107.1 C108.1 78.06,24.56 IC102.3
  Top 1.016: C106.1 63.5,33.02 70.48,40.01 117.26,40.01 119.86,37.41 119.86,30.3 119.41,29.84 X3.3
  Top 1.27: L103.2 58.24,16.94 61.25,13.93 C106.1
  pour Top (no thermals): 61.09,16 59.82,14.73 59.82,12.83 60.45,12.19 68.07,12.19 71.88,16 71.88,18.54 65.53,18.54 62.99,16
V_-5V0
  Top 0.508: C124.2 103.15,55.41 D103.2 102.34,55.88 100.57,57.66 R114.2 95.21,55.46 94.49,54.74 IC104.1
  Top 1.016: X3.6 115.15,26.84 117.36,24.64 119.51,24.64 121.81,26.94 121.81,36.3 121.79,36.32 121.79,49.15 115.53,55.41 C124.2

### Text on the board
tPlace: AC-DC-Supply-M1 | HW02.02 | Mains_L | Mains_N | 5V | 12V | 3.3V | 24V | -5V | GND